# EAGLE schematic internship_emu (EAGLE 9.4.2)
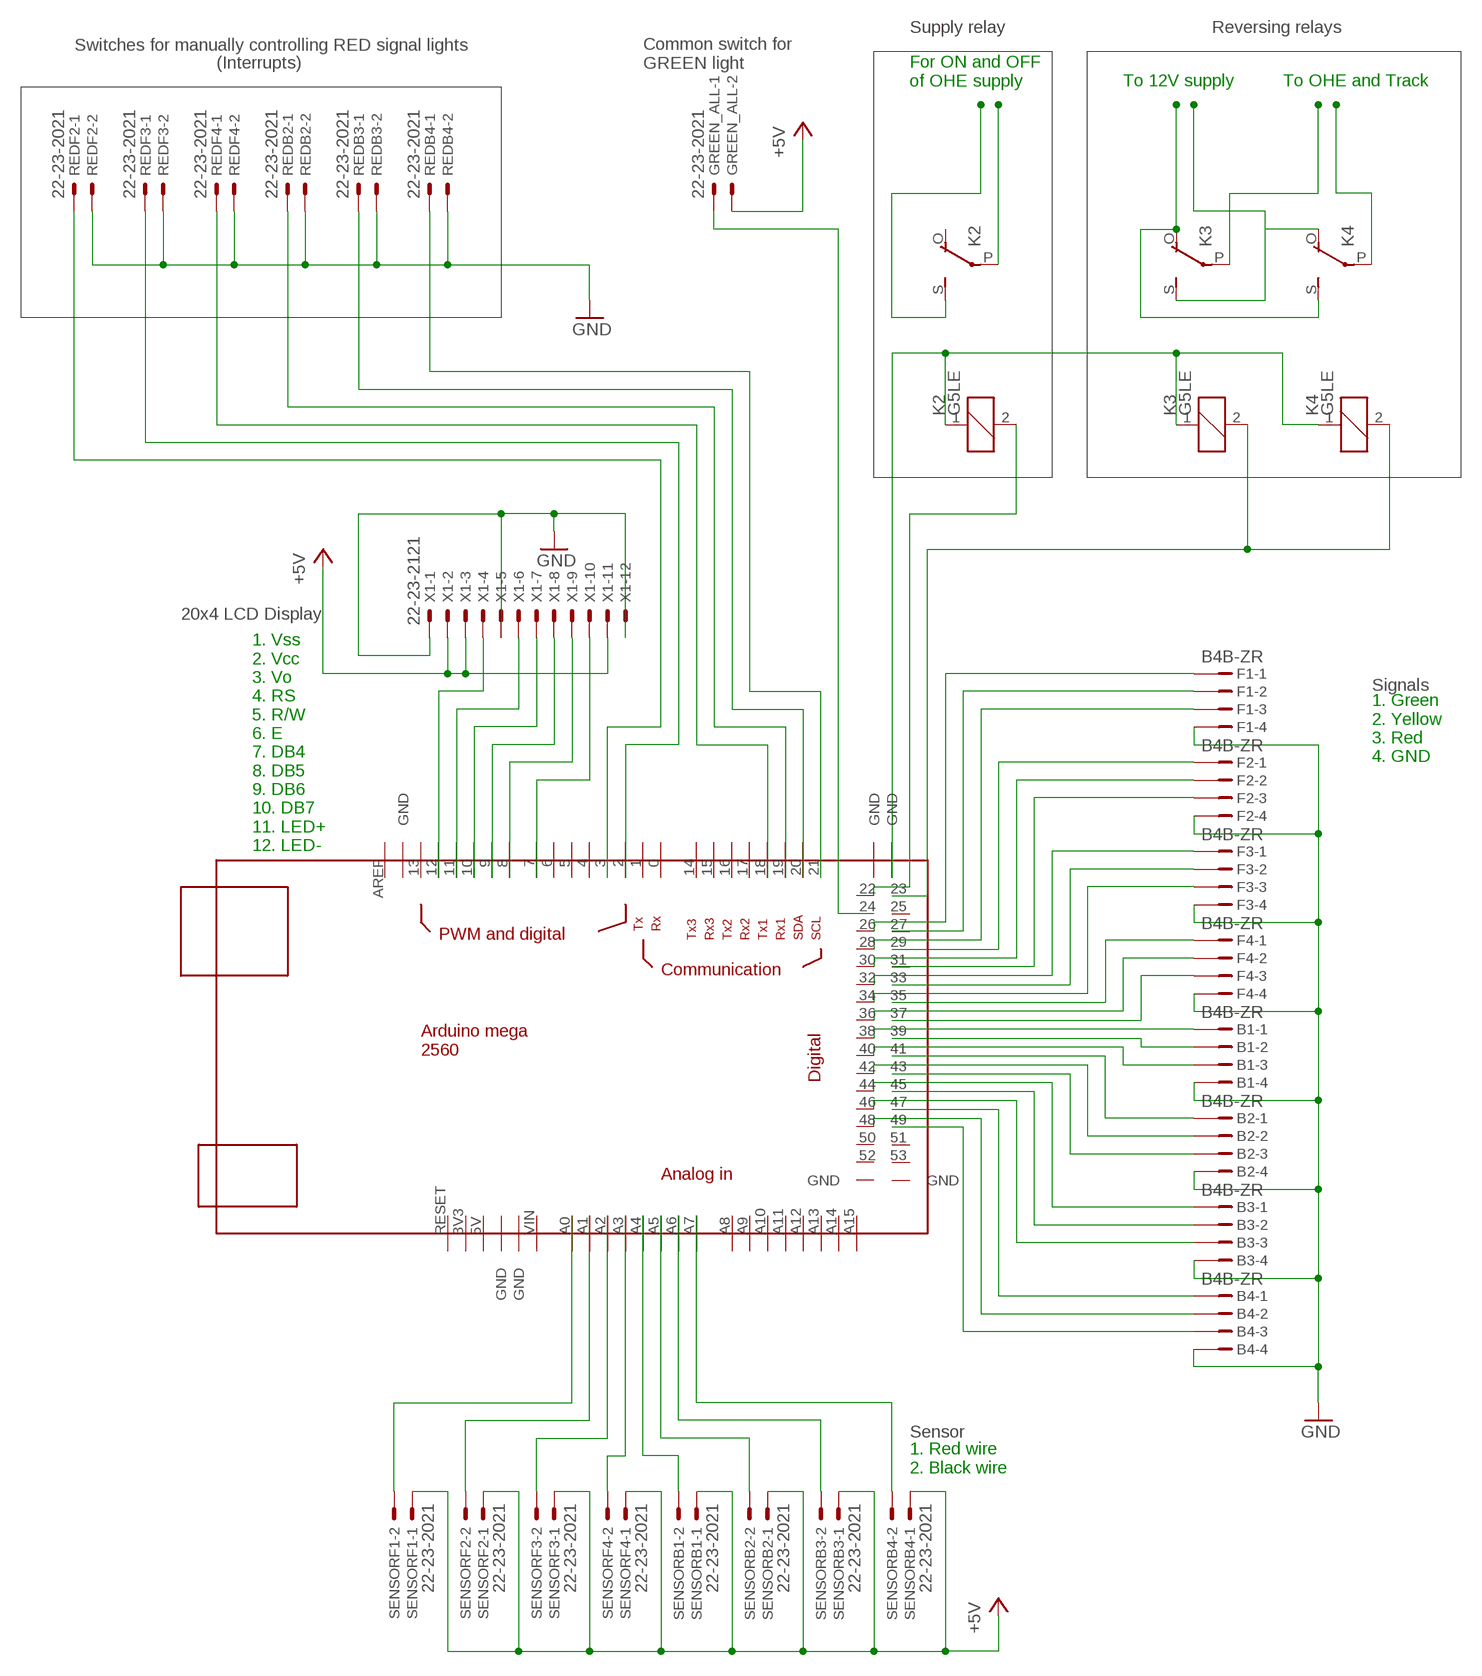
[diagram p0: schematic, sheet 1]

## Parts
B1  B4B-ZR  [B4B-ZR]
B2  B4B-ZR  [B4B-ZR]
B3  B4B-ZR  [B4B-ZR]
B4  B4B-ZR  [B4B-ZR]
F1  B4B-ZR  [B4B-ZR]
F2  B4B-ZR  [B4B-ZR]
F3  B4B-ZR  [B4B-ZR]
F4  B4B-ZR  [B4B-ZR]
GREEN_ALL  22-23-2021  [22-23-2021]
K2  G5LE  [G5LE]
K3  G5LE  [G5LE]
K4  G5LE  [G5LE]
REDB2  22-23-2021  [22-23-2021]
REDB3  22-23-2021  [22-23-2021]
REDB4  22-23-2021  [22-23-2021]
REDF2  22-23-2021  [22-23-2021]
REDF3  22-23-2021  [22-23-2021]
REDF4  22-23-2021  [22-23-2021]
SENSORB1  22-23-2021  [22-23-2021]
SENSORB2  22-23-2021  [22-23-2021]
SENSORB3  22-23-2021  [22-23-2021]
SENSORB4  22-23-2021  [22-23-2021]
SENSORF1  22-23-2021  [22-23-2021]
SENSORF2  22-23-2021  [22-23-2021]
SENSORF3  22-23-2021  [22-23-2021]
SENSORF4  22-23-2021  [22-23-2021]
U$1  MEGA_DEVICE  [MEGAOUTLINE]
X1  22-23-2121  [22-23-2121]

## Nets
+5V: GREEN_ALL.2 SENSORB1.1 SENSORB2.1 SENSORB3.1 SENSORB4.1 SENSORF1.1 SENSORF2.1 SENSORF3.1 SENSORF4.1 X1.2 X1.3 X1.11
GND: B1.4 B2.4 B3.4 B4.4 F1.4 F2.4 F3.4 F4.4 REDB2.2 REDB3.2 REDB4.2 REDF2.2 REDF3.2 REDF4.2 X1.1 X1.5 X1.12
N$1: B2.1 U$1.41
N$2: F1.2 U$1.27
N$3: F1.3 U$1.28
N$4: B2.2 U$1.42
N$5: F2.1 U$1.29
N$6: F1.1 U$1.26
N$7: F2.2 U$1.30
N$8: F2.3 U$1.31
N$9: F3.1 U$1.32
N$10: F3.2 U$1.33
N$11: F3.3 U$1.34
N$12: F4.1 U$1.35
N$13: F4.2 U$1.36
N$14: F4.3 U$1.37
N$15: B1.1 U$1.38
N$16: B1.2 U$1.39
N$17: B1.3 U$1.40
N$18: B2.3 U$1.43
N$19: B3.1 U$1.44
N$20: B3.2 U$1.45
N$21: B3.3 U$1.46
N$22: B4.1 U$1.47
N$23: B4.2 U$1.48
N$24: B4.3 U$1.49
N$25: SENSORF1.2 U$1.A0
N$26: SENSORF2.2 U$1.A1
N$27: SENSORF3.2 U$1.A2
N$28: SENSORF4.2 U$1.A3
N$29: SENSORB1.2 U$1.A4
N$30: SENSORB2.2 U$1.A5
N$31: SENSORB3.2 U$1.A6
N$32: SENSORB4.2 U$1.A7
N$33: GREEN_ALL.1 U$1.24
N$34: K2.2 U$1.22
N$35: K3.2 K4.2 U$1.23
N$36: U$1.12 X1.4
N$37: U$1.11 X1.6
N$38: U$1.10 X1.7
N$39: U$1.9 X1.8
N$40: U$1.8 X1.9
N$41: U$1.7 X1.10
N$42: K2.1 K3.1 K4.1 U$1.GND@5(GND)
N$43: K2.P(2:P)
N$44: K2.S(2:S)
N$45: K3.S(2:S) K4.O(2:O)
N$46: K3.O(2:O) K4.S(2:S)
N$47: K3.P(2:P)
N$48: K4.P(2:P)
N$49: REDF4.1 U$1.18
N$50: REDF2.1 U$1.3
N$51: REDF3.1 U$1.2
N$52: REDB2.1 U$1.19
N$53: REDB3.1 U$1.20
N$54: REDB4.1 U$1.21
Unconnected: K2.O(2:O) U$1.0 U$1.1 U$1.3V3 U$1.4 U$1.5 U$1.5V U$1.6 U$1.13 U$1.14 U$1.15 U$1.16 U$1.17 U$1.25 U$1.50 U$1.51 U$1.52 U$1.53 U$1.A8 U$1.A9 U$1.A10 U$1.A11 U$1.A12 U$1.A13 U$1.A14 U$1.A15 U$1.AREF U$1.GND@1(GND) U$1.GND@2(GND) U$1.GND@3(GND) U$1.GND@4(GND) U$1.GND@6(GND) U$1.GND@7(GND) U$1.RESET U$1.VIN

## Notes on the sheet
- Supply relay | Reversing relays
- Switches for manually controlling RED signal lights
- (Interrupts)
- Common switch for 
  GREEN light
- For ON and OFF 
  of OHE supply
- To 12V supply | To OHE and Track
- 20x4 LCD Display
- Signals
- 1. Green
  2. Yellow
  3. Red
  4. GND
- 1. Vss
  2. Vcc
  3. Vo
  4. RS
  5. R/W
  6. E
  7. DB4
  8. DB5
  9. DB6
  10. DB7
  11. LED+
  12. LED-
- Sensor
- 1. Red wire
  2. Black wire

## Library data of the parts
B1-B4 F1-F4 = con-jst:?4B-ZR: ZH CONNECTOR 1.5 mm, 4 pin 1 row Source: http://www.jst.com .. eZH.pdf; MF: FARNELL; MPN: B4B-ZR(LF)(SN); OC_FARNELL: 1830916; OC_NEWARK: 37K9960
GREEN_ALL REDB2-REDB4 REDF2-REDF4 SENSORB1-SENSORB4 SENSORF1-SENSORF4 = con-molex:22-23-2021: .100" (2.54mm) Center Header - 2 Pin; MF: MOLEX; MPN: 22-23-2021; OC_FARNELL: 1462926; OC_NEWARK: 25C3832
K2-K4 = relay:G5LE: RELAY 1 x switch, 10 A/120 V AC, 8 A/30 V DC, Omron; OC_FARNELL: unknown; OC_NEWARK: unknown
U$1 = ArduinoMegaOutline:MEGA_DEVICE: mega card as device
X1 = con-molex:22-23-2121: .100" (2.54mm) Center Header - 12 Pin; MF: MOLEX; MPN: 22-23-2121; OC_FARNELL: 1462935; OC_NEWARK: 56H0456